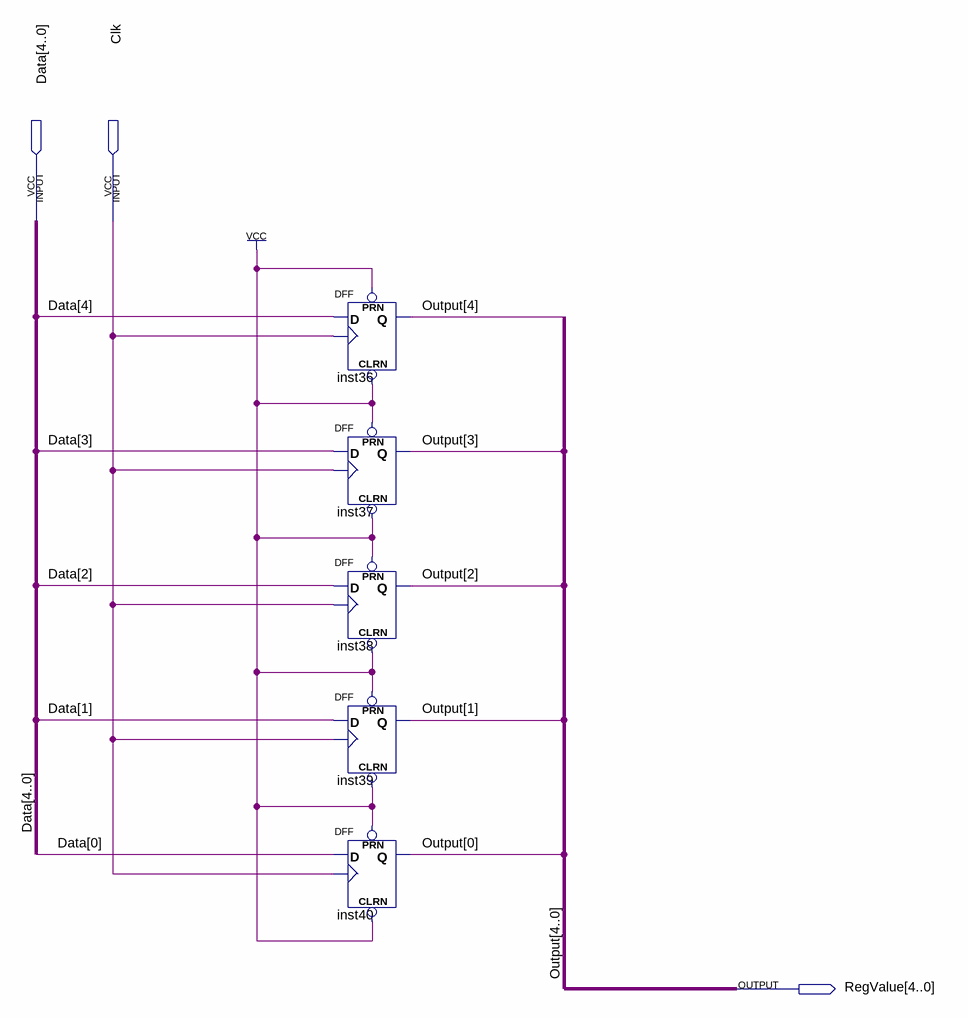
[diagram p0: schematic sheet]
// Quartus schematic Register_5bits.bdf as structural Verilog: 5 symbols, 3 pins
module Register_5bits (
  input  [4:0] Data,
  input  Clk,
  output [4:0] RegValue
);

  DFF inst36 (.CLRN(1'b1), .CLK(Clk), .D(Data[4]), .PRN(1'b1), .Q(RegValue[4]));
  DFF inst37 (.CLRN(1'b1), .CLK(Clk), .D(Data[3]), .PRN(1'b1), .Q(RegValue[3]));
  DFF inst38 (.CLRN(1'b1), .CLK(Clk), .D(Data[2]), .PRN(1'b1), .Q(RegValue[2]));
  DFF inst39 (.CLRN(1'b1), .CLK(Clk), .D(Data[1]), .PRN(1'b1), .Q(RegValue[1]));
  DFF inst40 (.CLRN(1'b1), .CLK(Clk), .D(Data[0]), .PRN(1'b1), .Q(RegValue[0]));

  // Other names for the same wires on the sheet: Output[4:0] = RegValue
endmodule
